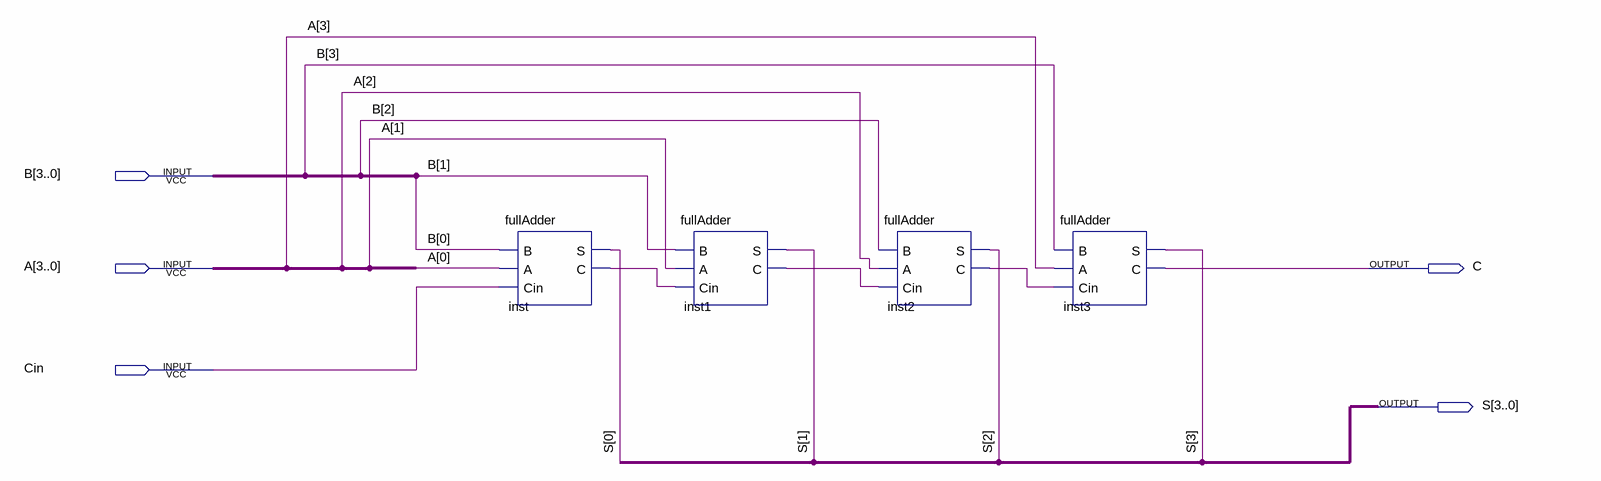
[diagram p0: schematic sheet]
// Quartus schematic rippleCarryAdder_4bit.bdf as structural Verilog: 4 symbols, 5 pins
module rippleCarryAdder_4bit (
  input  [3:0] B,
  input  [3:0] A,
  input  Cin,
  output C,
  output [3:0] S
);

  wire inst1_c, inst2_c, inst_c;

  fullAdder inst (.B(B[0]), .A(A[0]), .Cin(Cin), .S(S[0]), .C(inst_c));
  fullAdder inst1 (.B(B[1]), .A(A[1]), .Cin(inst_c), .S(S[1]), .C(inst1_c));
  fullAdder inst2 (.B(B[2]), .A(A[2]), .Cin(inst1_c), .S(S[2]), .C(inst2_c));
  fullAdder inst3 (.B(B[3]), .A(A[3]), .Cin(inst2_c), .S(S[3]), .C(C));
endmodule
